# EAGLE design ABS-Pro-Mini (EAGLE 7.2.0)
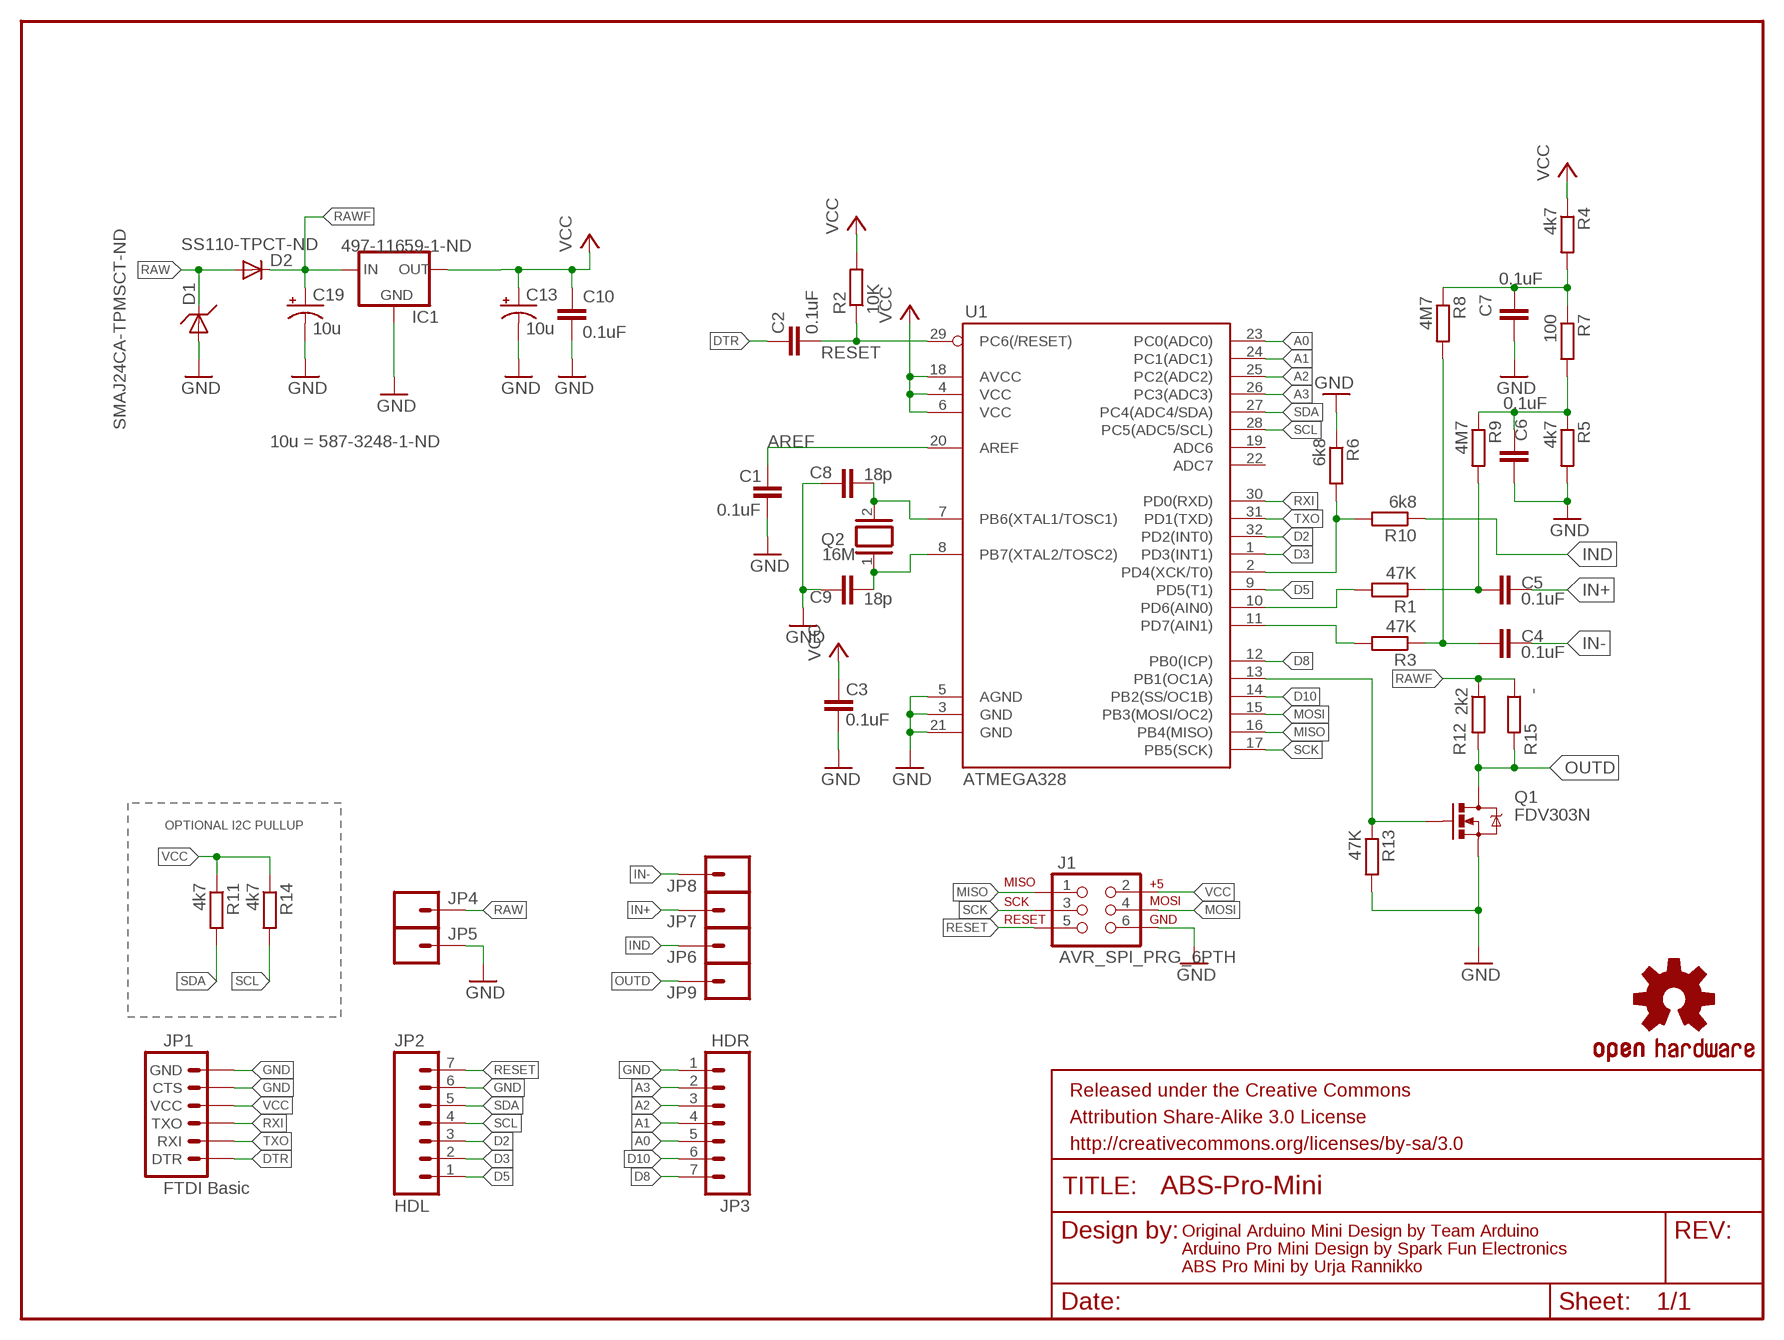
[diagram p0: schematic, sheet 1]

## Parts
C1  0.1uF  CAP0603-CAP  [0603-CAP]
C2  0.1uF  CAP0603-CAP  [0603-CAP]
C3  0.1uF  CAP0603-CAP  [0603-CAP]
C4  0.1uF  CAP0603-CAP  [0603-CAP]
C5  0.1uF  CAP0603-CAP  [0603-CAP]
C6  0.1uF  CAP0603-CAP  [0603-CAP]
C7  0.1uF  CAP0603-CAP  [0603-CAP]
C8  18p  CAP0603-CAP  [0603-CAP]
C9  18p  CAP0603-CAP  [0603-CAP]
C10  0.1uF  CAP0603-CAP  [0603-CAP]
C13  10u  CAP_POL1206  [EIA3216]
C19  10u  CAP_POL1206  [EIA3216]
D1  SMAJ24CA-TPMSCT-ND  DIODESMA  [SMA-DIODE]
D2  SS110-TPCT-ND  DIODESMA  [SMA-DIODE]
FRAME1  FRAME-LETTER  [CREATIVE_COMMONS]
IC1  497-11659-1-ND  V_REG_MIC2920MG  [SOT223]
J1  AVR_SPI_PRG_6PTH  [2X3]
JP1  FTDI Basic  ARDUINO_SERIAL_PROGRAMPTH  [1X06]
JP2  HDL  M07  [1X07]
JP3  HDR  M07  [1X07]
JP4  M01PTH_2MM  [1X01_2MM]
JP5  M01PTH_2MM  [1X01_2MM]
JP6  M01PTH_2MM  [1X01_2MM]
JP7  M01PTH_2MM  [1X01_2MM]
JP8  M01PTH_2MM  [1X01_2MM]
JP9  M01PTH_2MM  [1X01_2MM]
Q1  FDV303N  MOSFET-NCHANNELBSS123LT1G  [SOT23]
Q2  16M  XTAL/S  [QS]
R1  47K  R-EU_R0805  [R0805]
R2  10K  R-EU_R0805  [R0805]
R3  47K  R-EU_R0805  [R0805]
R4  4k7  R-EU_R0805  [R0805]
R5  4k7  R-EU_R0805  [R0805]
R6  6k8  R-EU_R0805  [R0805]
R7  100  R-EU_R0805  [R0805]
R8  4M7  R-EU_0207/12  [0207/12]
R9  4M7  R-EU_0207/12  [0207/12]
R10  6k8  R-EU_R0805  [R0805]
R11  4k7  R-EU_R0805  [R0805]
R12  2k2  R-EU_R0805  [R0805]
R13  47K  R-EU_R0805  [R0805]
R14  4k7  R-EU_R0805  [R0805]
R15  -  R-EU_R0805  [R0805]
U1  ATMEGA328  ATMEGA168  [TQFP32-08]
U$3  OSHW-LOGOS  [OSHW-LOGO-S]

## Nets
A0: JP3.5 U1.23(PC0(ADC0))
A1: JP3.4 U1.24(PC1(ADC1))
A2: JP3.3 U1.25(PC2(ADC2))
A3: JP3.2 U1.26(PC3(ADC3))
AREF: C1.2 U1.20(AREF)
BIASH: C7.1 R4.2 R7.1 R8.1
BIASL: C6.1 R5.1 R7.2 R9.1
CIN+: C5.2 R1.1 R9.2
CIN-: C4.2 R3.1 R8.2
D2: JP2.3 U1.32(PD2(INT0))
D3: JP2.2 U1.1(PD3(INT1))
D5: JP2.1 U1.9(PD5(T1))
D8: JP3.7 U1.12(PB0(ICP))
D10: JP3.6 U1.14(PB2(SS/OC1B))
DIN+: R1.2 U1.10(PD6(AIN0))
DIN-: R3.2 U1.11(PD7(AIN1))
DTR: C2.2 JP1.1(DTR)
GND [vcc]: C1.1 C3.1 C6.2 C7.2 C8.2 C9.2 C10.2 C13.C(-) C19.C(-) D1.A IC1.2(GND) IC1.4(GND) J1.6 JP1.5(CTS) JP1.6(GND) JP2.6 JP3.1 JP5.1 Q1.2(S) R5.2 R6.1 R13.2 U1.3(GND) U1.5(AGND) U1.21(GND)
IN+: C5.1 JP7.1
IN-: C4.1 JP8.1
IND: JP6.1 R10.1
INDLV: R6.2 R10.2 U1.2(PD4(XCK/T0))
MISO: J1.1 U1.16(PB4(MISO))
MOSI: J1.4 U1.15(PB3(MOSI/OC2))
N$1: C9.1 Q2.1 U1.8(PB7(XTAL2/TOSC2))
N$2: C8.1 Q2.2 U1.7(PB6(XTAL1/TOSC1))
OUTD: JP9.1 Q1.3(D) R12.2 R15.2
OUTD_CTRL: Q1.1(G) R13.1 U1.13(PB1(OC1A))
RAW [vcc]: D1.C D2.A JP4.1
RAWF: C19.A(+) D2.C IC1.1(IN) R12.1 R15.1
RESET: C2.1 J1.5 JP2.7 R2.1 U1.29(PC6(/RESET))
RXI: JP1.3(TXO) U1.30(PD0(RXD))
SCK: J1.3 U1.17(PB5(SCK))
SCL: JP2.4 R14.2 U1.28(PC5(ADC5/SCL))
SDA: JP2.5 R11.2 U1.27(PC4(ADC4/SDA))
TXO: JP1.2(RXI) U1.31(PD1(TXD))
VCC: C3.2 C10.1 C13.A(+) IC1.3(OUT) J1.2 JP1.4(VCC) R2.2 R4.1 R11.1 R14.1 U1.4(VCC) U1.6(VCC) U1.18(AVCC)
Unconnected: U1.19(ADC6) U1.22(ADC7)

## Notes on the sheet
- 10u = 587-3248-1-ND
- OPTIONAL I2C PULLUP
- Original Arduino Mini Design by Team Arduino
- Arduino Pro Mini Design by Spark Fun Electronics
- ABS Pro Mini by Urja Rannikko

## Library data of the parts
C1-C10 = SparkFun:CAP: Capacitor Standard 0603 ceramic capacitor, and 0.1" leaded capacitor.
C13 C19 = SparkFun:CAP_POL: Capacitor Polarized These are standard SMD and PTH capacitors. Normally 10uF, 47uF, and 100uF in electrolytic and tantalum varieties. Always verify the external diameter of the through hole cap, it varies with capacity, voltage, and manufacturer. The EIA devices should be standard.
D1 D2 = SparkFun-DiscreteSemi:DIODE: Diode These are standard reverse protection diodes and small signal diodes. SMA package can handle up to about 1A. SOD-323 can handle about 200mA. What the SOD-323 package when ordering, there are some mfgs out there that are 5-pin packages.
FRAME1 = SparkFun-Aesthetics:FRAME-LETTER: Schematic Frame Standard 8.5x11 US Letter frame
IC1 = SparkFun-PowerIC:V_REG_MIC2920: MIC2920A (http://www.micrel.com/_PDF/mic2920.pdf) - 400mA output LDO Regulator
J1 = SparkFun-Connectors:AVR_SPI_PRG_6: AVR ISP 6 Pin This is the reduced ISP connector for AVR programming. Common on Arduino. This footprint will take up less PCB space and can be used with a 10-pin to 6-pin adapter such as SKU: BOB-08508
JP1 = SparkFun:ARDUINO_SERIAL_PROGRAM
JP2 JP3 = SparkFun-Connectors:M07: Header 7 Standard 7-pin 0.1" header. Use with straight break away headers (SKU : PRT-00116), right angle break away headers (PRT-00553), swiss pins (PRT-00743), machine pins (PRT-00117), and female headers (PRT-00115). NOTES ON THE VARIANTS LOCK and LOCK_LONGPADS... This footprint was designed to help hold the alignment of a through-hole component (i.e. 7-pin header) while soldering it into place. You may notice that each hole has been shifted either up or down by 0.005 of an inch from it's more standard position (which is usually a perfectly straight line). This slight alteration caused the pins (the squares in the middle) to touch the edges of the holes. Because they are alternating, it causes a "brace" to hold the header in place. 0.005 has proven to be the perfect amount of "off-center" position when using our standard breakaway headers. Although looks a little odd when you look at the bare footprint, once you have a header in there, the alteration is very hard to notice. Also, if you push a header all the way into place, it is covered up entirely on the bottom side. This idea of altering the position of holes to aid alignment will be further integrated into the Sparkfun Library for other footprints. It can help hold any component with 3 or more connection pins.
JP4-JP9 = SparkFun-Connectors:M01: Header 1 Standard 1-pin 0.1" header. Use with straight break away headers (SKU : PRT-00116), right angle break away headers (PRT-00553), swiss pins (PRT-00743), machine pins (PRT-00117), and female headers (PRT-00115).
Q1 = SparkFun-DiscreteSemi:MOSFET-NCHANNEL: Common NMOSFET Parts MFG P/N Store ID Prod ID FDD8780 TRANS-09984 SI7820DN TRANS-11055 FDS6630A IC-08089 2N7002PW TRANS-11151 FQP30N06L COM-10213 TRANS-10060 BSS123LT1G TRANS-08345 BSS138 TRANS-00830 BS170 2N7000; PROD_ID: TRANS-08345
Q2 = special:XTAL/S: CRYSTAL
R1-R15 = rcl:R-EU_: RESISTOR, European symbol
U1 = SparkFun:ATMEGA168
U$3 = SparkFun:OSHW-LOGO: Open Source Hardware Logo This logo indicates the piece of hardware it is found on incorporates a OSHW license and/or adheres to the definition of open source hardware found here: http://freedomdefined.org/OSHW

## Net classes
0 default: width 0.203 mm
1 vcc: width 0.254 mm

## Board
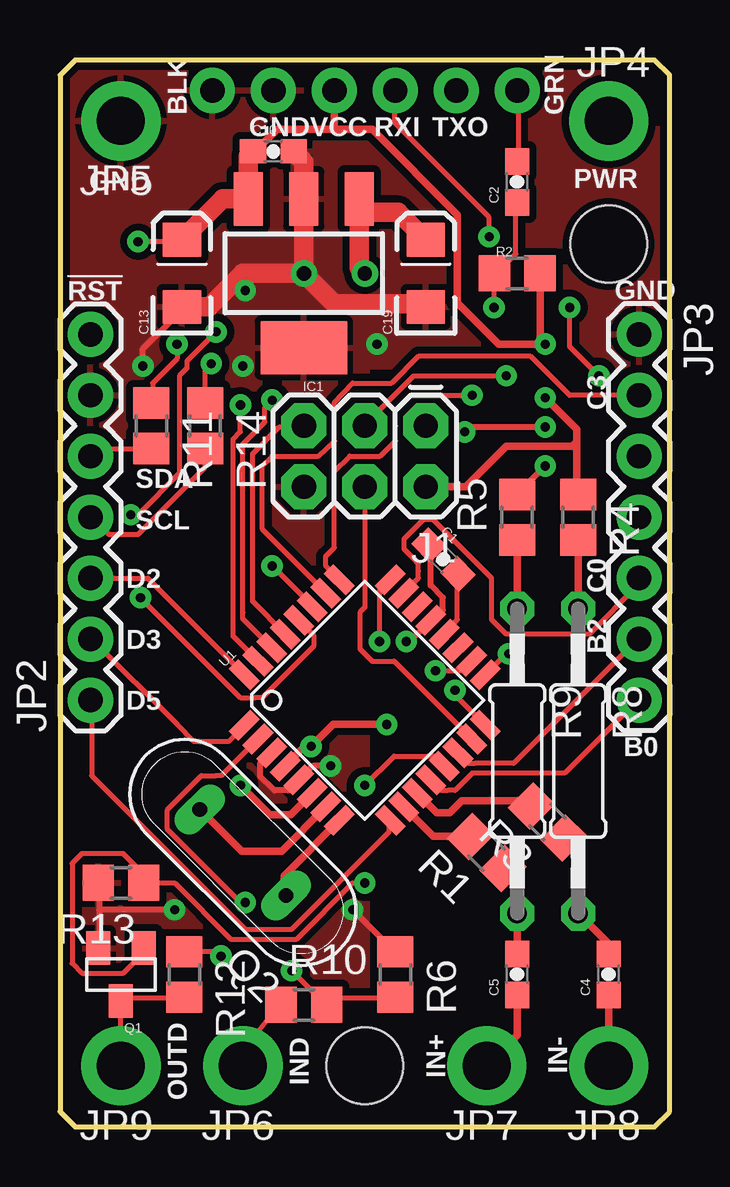
[diagram p1: board, top side]
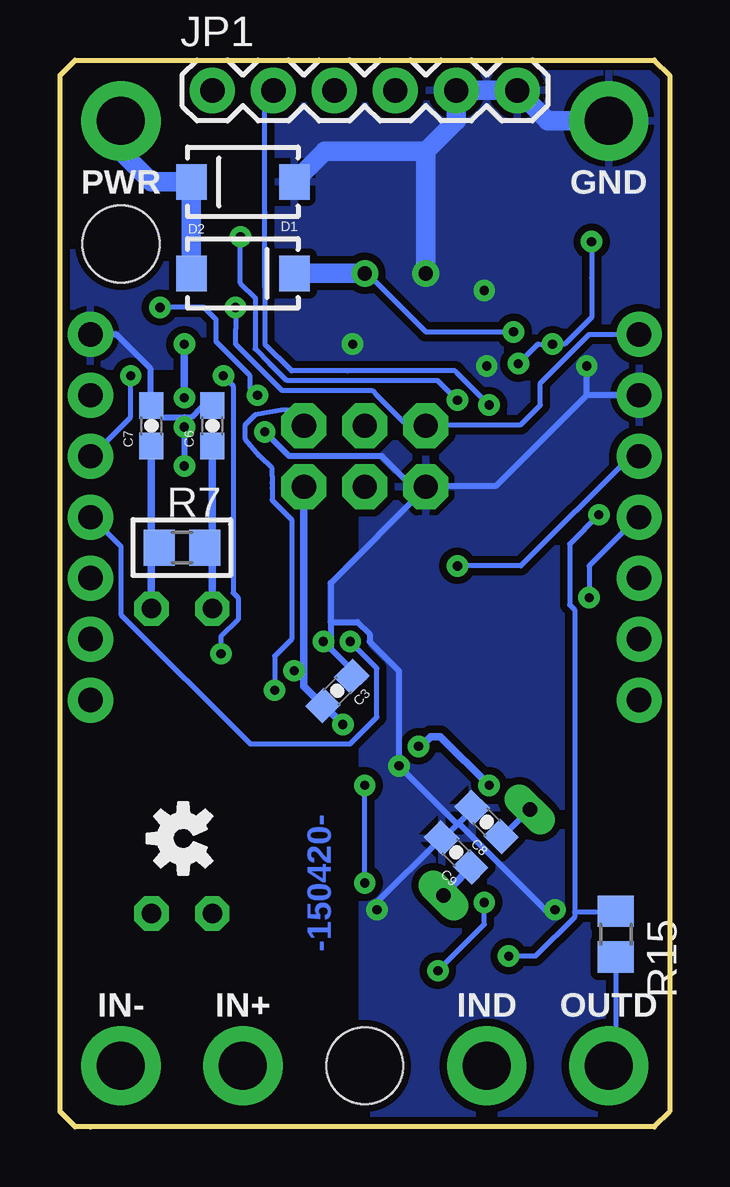
[diagram p2: board, bottom side, seen from below]

Size 25.4 x 44.45 mm. Coordinates in mm from the lower left corner, seen from the top.
Outline: 0.64,44.45 0,43.81 0,0.64 0.64,0 24.13,0 24.77,0 25.4,0.64 25.4,43.81 24.77,44.45 0.64,44.45
Copper layers (1*16): Top 0.035mm / dielectric 1.5mm / Bottom 0.035mm
Design rules "SparkFun-2-layer *": minimum track width 7mil, minimum drill 15mil, track to track 8mil, track to pad 8mil, pad to pad 8mil, via to via 8mil, smd to smd 8mil, copper to edge 8mil, drill to drill 8mil, minimum pad ring 12mil, minimum via ring 10mil, stop-mask expansion 4mil, vias tented up to drill 24mil, thermal gap 10mil
Holes 3.2 mm at 12.7,2.54 22.86,36.78

### Footprints (pad centres in the part's own frame; a part is rotated, then mirrored left to right if it is on the bottom)
0603-CAP = smd 1.1 x 1: 1 -0.85,0; 2 0.85,0
EIA3216 = smd 1.4 x 1.6: A 1.4,0; C -1.4,0
SMA-DIODE = smd 1.27 x 1.47: A -2.15,0; C 2.15,0
SOT223 = smd 1.219 x 2.235: 1 -2.311,-3.099; 2 0,-3.099; 3 2.311,-3.099 | smd 3.6 x 2.2: 4 0,3.099
2X3 = drill 1.016 pad 1.88 octagon: 1 0,0; 2 0,2.54; 3 2.54,0; 4 2.54,2.54; 5 5.08,0; 6 5.08,2.54
1X06 = drill 1.016 pad 1.88: 1 0,0; 2 2.54,0; 3 5.08,0; 4 7.62,0; 5 10.16,0; 6 12.7,0
1X07 = drill 1.016 pad 1.88: 1 0,0; 2 2.54,0; 3 5.08,0; 4 7.62,0; 5 10.16,0; 6 12.7,0; 7 15.24,0
1X01_2MM = drill 2 pad 3.302: 1 0,0
SOT23 = smd 1 x 1.4: 1 -0.95,-1.1; 2 0.95,-1.1; 3 0,1.1
QS = drill 0.61 long: 1 -2.54,0; 2 2.54,0
R0805 = smd 1.3 x 1.5: 1 -0.95,0; 2 0.95,0
0207/12 = drill 0.813 octagon: 1 -6.35,0; 2 6.35,0
TQFP32-08 = smd 1.27 x 0.559: 1 -4.293,2.8; 2 -4.293,2; 3 -4.293,1.2; 4 -4.293,0.4; 5 -4.293,-0.4; 6 -4.293,-1.2; 7 -4.293,-2; 8 -4.293,-2.8; 17 4.293,-2.8; 18 4.293,-2; 19 4.293,-1.2; 20 4.293,-0.4; 21 4.293,0.4; 22 4.293,1.2; 23 4.293,2; 24 4.293,2.8 | smd 0.559 x 1.27: 9 -2.8,-4.293; 10 -2,-4.293; 11 -1.2,-4.293; 12 -0.4,-4.293; 13 0.4,-4.293; 14 1.2,-4.293; 15 2,-4.293; 16 2.8,-4.293; 25 2.8,4.293; 26 2,4.293; 27 1.2,4.293; 28 0.4,4.293; 29 -0.4,4.293; 30 -1.2,4.293; 31 -2,4.293; 32 -2.8,4.293

### Placement (x,y rotation side)
C1  15.98,23.65 315 top
C2  19.05,39.37 90 top
C3  13.84,18.16 225 bottom
C4  22.86,6.35 90 top
C5  19.05,6.35 90 top
C6  19.05,29.21 90 bottom
C7  21.59,29.21 90 bottom
C8  7.62,12.7 135 bottom
C9  8.89,11.43 135 bottom
C10  8.89,40.64 0 top
C13  5.08,35.56 90 top
C19  15.24,35.56 90 top
D1  17.78,39.37 180 bottom
D2  17.78,35.56 0 bottom
FRAME1  -15.98,-8.89 0 top  (outside the outline)
IC1  10.16,35.56 180 top
J1  15.24,29.21 180 top
JP1  19.05,43.18 0 bottom
JP2  1.27,17.78 90 top
JP3  24.13,33.02 270 top
JP4  22.86,41.91 0 top
JP5  2.54,41.91 180 top
JP6  7.62,2.54 180 top
JP7  17.78,2.54 180 top
JP8  22.86,2.54 180 top
JP9  2.54,2.54 180 top
Q1  2.54,6.35 180 top
Q2  7.62,11.43 135 top
R1  17.78,11.43 135 top
R2  19.05,35.56 0 top
R3  20.32,12.7 135 top
R4  21.59,25.4 270 top
R5  19.05,25.4 90 top
R6  13.97,6.35 270 top
R7  20.32,24.13 0 bottom
R8  21.59,15.24 270 top
R9  19.05,15.24 270 top
R10  10.16,5.08 0 top
R11  3.81,29.21 270 top
R12  5.18,6.35 270 top
R13  2.54,10.16 180 top
R14  6.05,29.21 270 top
R15  2.24,8.03 270 bottom
U1  12.7,17.78 45 top
U$3  20.27,12.01 90 bottom

### Tracks (layer width: path | path; a pad name or v marks a point on that pad's centre or on a via)
A0
  Top 0.203: U1.23 14.33,22.25 14.94,22.86 14.94,23.16 14.94,23.47 14.73,23.67 14.33,24.08 14.33,24.49 15.14,25.3 15.54,25.3 17.98,22.86 17.98,21.13 18.59,20.52 22.05,20.52 24.08,22.55 24.08,22.86 JP3.5
A1  (via drill 0.38)
  Top 0.203: U1.24 13.31,22.35 v13.31,20.22
  Bottom 0.203: v13.31,20.22 12.19,19.1 12.19,17.07 13.31,15.95 17.48,15.95 22.86,21.34 22.86,24.18 24.08,25.4 JP3.4
A2  (via drill 0.38)
  Top 0.203: U1.25 11.58,22.86 11.07,23.37 11.07,23.77 11.43,24.13 11.43,27.3 12.06,27.94 13.34,27.94 13.97,28.57 13.97,29.21 13.97,29.84 14.61,30.48 v17.17,30.48 | v21.23,34.14 21.23,32.51 v22.45,31.29
  Bottom 0.203: v22.45,31.29 22.45,29.57 24.08,27.94 JP3.3 | v17.17,30.48 17.48,30.79 17.48,31.29 18.9,32.72 18.9,33.63 19.41,34.14 v21.23,34.14
A3
  Top 0.203: U1.26 11.07,22.25 8.43,24.89 8.43,27.53 8.84,27.94 10.77,27.94 11.43,28.57 11.43,30.18 12.19,30.99 13.82,30.99 14.94,32.11 19.61,32.11 21.23,30.48 24.08,30.48 JP3.2
AREF
  Top 0.203: C1.2 16.56,22.96 16.56,21.13 16.05,20.62 U1.20
BIASH
  Top 0.305: R4.2 R8.1
  Bottom 0.305: R8.1 21.59,24.13 R7.1 21.27,24.45 R4.2 C7.1
BIASL
  Top 0.305: R5.1 R9.1
  Bottom 0.305: R9.1 19.05,24.13 R7.2 19.37,24.45 R5.1 C6.1
CIN+
  Top 0.305: C5.2 R9.2 19.05,10.16 | 19.05,10.16 | 19.05,10.16 R1.1
CIN-
  Top 0.305: C4.2 22.86,7.62 R8.2 21.59,11.43 R3.1
D2
  Top 0.203: U1.32 7.62,18.9 3.66,22.86 1.32,22.86 JP2.3
D3
  Top 0.203: JP2.2 1.32,20.32 4.88,16.76 5.59,16.05 6.5,16.05 7.01,16.05 U1.1
D5
  Top 0.203: U1.9 13.72,12.7 13.72,12.29 9.65,8.23 7.72,8.23 1.32,14.63 1.32,17.78 JP2.1
D8
  Top 0.203: JP3.7 24.08,17.78 21.03,14.73 17.17,14.73 16.46,14.02 16.15,14.02 15.89,14.02 U1.12
D10
  Top 0.203: JP3.6 24.08,20.32 18.9,15.14 17.27,15.14 17.04,15.14 U1.14
DIN+
  Top 0.305: U1.10 15.55,12.1 R1.2
DIN-
  Top 0.305: U1.11 15.41,13.37 15.7,13.08 16.23,13.08 16.74,13.59 18.54,13.59 19.43,13.59 arc-90 R3.2
DTR
  Top 0.203: C2.2 19.1,40.23 19.1,43.18 JP1.1
GND  (via drill 0.38, 0.6)
  Top 0.254: 1.63,9.04 1.63,10.16 R13.2 | 1.63,9.04 1.63,7.52 Q1.2 | U1.3 8.74,15.54 8.33,15.14 8.33,14.63 8.94,14.02 9.51,14.02 U1.5 10.52,15.04 10.57,15.04 11.18,15.04 v11.28,15.04 | v12.19,9.04 13.92,7.32 R6.1 | v4.78,9.04 1.73,9.04 1.63,9.04 | v20.22,27.53 19.1,26.42 R5.2 | C1.1 15.44,24.18 15.44,22.55 15.95,22.05 15.95,21.54 15.54,21.13 U1.21 14.57,20.22 v14.43,20.22 | v20.22,29.16 17.07,29.16 v16.87,28.96 | v3.45,31.7 3.45,32.41 4.88,33.83 C13.C
  Top 0.813: v10.16,35.56 10.16,38.1 | 10.16,38.1 IC1.2 | C10.2 10.16,40.22 10.16,39.37 10.16,38.1 | v10.16,35.56 7.62,35.56 6.22,34.16 C13.C | C19.C 15.11,34.29 11.43,34.29 v10.16,35.56
  Bottom 0.254: 8.84,12.6 9.45,11.99 C9.2 9.55,11.99 12.19,9.35 v12.19,9.04 | 8.84,12.6 8.79,12.65 | 8.79,12.65 8.23,13.21 C8.2 | 8.84,12.6 v11.28,15.04 11.28,15.14 11.28,19 12.5,20.22 12.5,20.52 13.01,21.03 14.02,21.03 14.12,21.03 | v4.78,9.04 5.18,9.04 8.74,12.6 8.79,12.65 | 20.22,29.57 21.13,29.57 21.54,29.97 C7.2 21.64,30.18 21.64,31.6 23.06,33.02 24.08,33.02 JP3.1 | 20.22,29.57 19.91,29.57 19.51,29.97 19.1,29.97 C6.2 | v20.22,27.53 v20.22,29.16 20.22,29.46 20.22,29.57 | 14.12,21.03 14.12,22.66 10.16,26.62 J1.6 | 14.12,21.03 14.12,20.22 | 14.12,20.22 14.12,19.91 13.31,19.1 13.31,18.8 C3.1 | v14.43,20.22 14.22,20.22 14.12,20.22 | JP2.6 1.32,30.48 3.45,30.48 | J1.6 10.06,26.72 7.21,26.72 3.45,30.48 | v16.87,28.96 15.85,27.94 11.99,27.94 10.46,26.42 J1.6 | v3.45,31.7 3.45,30.58 3.45,30.48
  Bottom 0.813: JP5.1 5.08,41.91 JP1.6 JP1.5 8.89,41.91 10.16,40.64 | 10.16,40.64 14.36,40.64 D1.A | 10.16,40.64 v10.16,35.56
  other vias: 13.21,32.61 7.62,31.7 7.72,34.85
  pour Top (isolate 0.305): 0,0 12.8,0 12.8,31.7 25.4,31.7 25.4,44.5 0,44.5
  pour Bottom (isolate 0.305): 0,0 12.8,0 12.8,31.7 25.4,31.7 25.4,44.5 0,44.5
  pour Bottom (isolate 0.254): 12.8,21.03 14.12,21.03 14.12,22.66 12.9,23.88 12.8,23.98
IN+
  Top 0.305: JP7.1 19.05,3.81 C5.1
IN-
  Top 0.305: JP8.1 C4.1
IND
  Top 0.203: JP6.1 7.62,3.15 9.14,5.08 R10.1
INDLV  (via drill 0.38)
  Top 0.203: v7.72,9.35 7.52,9.35 4.47,12.39 4.47,13.21 5.89,14.63 6.5,14.63 6.72,14.63 U1.2 | v9.65,6.5 11.07,5.08 R10.2 11.18,5.08 11.48,5.38 13.92,5.38 R6.2
  Bottom 0.203: v7.72,9.35 7.72,8.43 v9.65,6.5
MISO  (via drill 0.38)
  Top 0.203: U1.16 16.46,17.98 v16.46,18.19
  Bottom 0.203: J1.1 15.24,29.26 15.85,29.87 16.05,29.87 17.27,29.67 17.68,29.26 17.68,28.65 17.07,27.94 16.56,27.43 16.56,27.13 16.56,26.82 16.56,26.62 16.56,26.11 15.95,25.5 15.75,25.3 15.75,20.32 16.36,19.71 16.46,19.61 v16.46,18.19
MOSI
  Top 0.203: U1.15 17.07,16.26 13.92,19.41 13.01,19.41 12.5,19.91 12.5,21.44 12.7,21.64 12.7,26.62 J1.4
N$1
  Top 0.305: U1.8 9.35,10.47 9.35,10.46 9.35,9.7 Q2.1
  Bottom 0.305: Q2.1 C9.1
N$2
  Top 0.305: U1.7 9.23,11.48 7.62,11.48 7.57,11.48 Q2.2
  Bottom 0.254: Q2.2 6.95,12.1 C8.1
OUTD
  Top 0.203: JP9.1 2.54,5.18 Q1.3 2.54,5.28 2.64,5.38 5.08,5.38 R12.2
  Bottom 0.203: R15.2 2.23,2.85 JP9.1
OUTD_CTRL  (via drill 0.38)
  Top 0.203: v12.7,14.22 13.92,15.44 15.34,15.44 15.6,15.44 U1.13 | v12.7,10.16 12.19,10.16 9.86,7.82 7.11,7.82 4.78,10.16 3.86,10.16 | 3.86,10.16 3.56,10.16 R13.1 3.86,10.16 | 3.86,10.16 2.64,11.38 0.91,11.38 0.51,10.97 0.51,6.81 0.91,6.4 2.64,6.4 3.66,7.42 Q1.1
  Bottom 0.203: v12.7,10.16 v12.7,14.22
RAW
  Bottom 0.813: JP4.1 22.86,40.64 21.59,39.37 D1.C D2.A
RAWF  (via drill 0.38, 0.6)
  Top 0.203: v6.5,33.12 5.28,31.9 5.28,31.6 4.98,31.29 4.98,27.23 3.25,25.5 v2.95,25.5 | 5.08,7.32 5.18,7.32 | 5.18,7.32 6.5,7.32 v6.71,7.11 | R12.1 5.18,7.32
  Top 0.813: IC1.1 12.47,38.1 | 12.47,38.1 12.47,35.79 v12.7,35.56 | C19.A 14.1,38.1 12.47,38.1
  Bottom 0.203: v6.71,7.11 5.59,7.11 3.96,8.74 3.96,8.94 | 3.96,8.94 3.96,21.54 4.17,21.74 4.17,24.28 v2.95,25.5 | v6.5,33.12 10.16,33.12 12.39,35.36 v12.7,35.56 | R15.1 2.27,8.94 3.96,8.94
  Bottom 0.813: v12.7,35.56 D2.C
RESET  (via drill 0.38)
  Top 0.203: C2.1 19,38.51 19,36.37 18.19,35.56 R2.1 18.09,35.56 v18.09,34.14 | U1.29 8.03,21.89 8.03,22.15 8.03,28.04 9.14,29.16 10.11,29.16 J1.5
  Bottom 0.203: 10.16,29.26 J1.5 | 10.16,29.26 J1.5 | JP2.7 1.32,33.02 3.35,33.02 5.38,30.99 5.38,30.07 6.2,29.26 10.16,29.26 | 10.16,29.26 10.97,29.26 12.19,30.48 12.39,30.68 16.15,30.68 17.37,31.9 18.09,32.61 18.09,33.22 v18.09,34.14 | 10.16,29.26 J1.5
RXI  (via drill 0.38)
  Top 0.203: U1.30 7.62,21.16 7.62,21.44 7.62,28.45 8.53,29.36 8.53,29.97 v8.84,30.28 | v17.88,37.08 17.88,37.9 13.92,41.86 13.92,43.18 JP1.3
  Bottom 0.203: v17.88,37.08 17.88,35.15 17.27,34.54 17.27,32.41 16.66,31.8 15.95,31.09 9.65,31.09 9.55,30.99 v8.84,30.28
SCK  (via drill 0.38)
  Top 0.203: v18.69,19.71 18.59,19.71 17.78,18.9 U1.17 | v18.59,31.29 14.73,31.29 12.7,29.26 J1.3
  Bottom 0.203: v18.69,19.71 18.69,20.42 17.98,21.13 17.98,22.05 18.19,22.25 18.19,30.89 v18.59,31.29
SCL  (via drill 0.38)
  Top 0.203: v3.35,22.05 7.52,17.88 8.13,17.88 8.43,17.88 10.57,20.02 10.57,20.48 U1.28 9.95,21.04 | JP2.4 1.32,25.4 2.03,24.69 3.25,24.69 6.04,27.48 R14.2 | 9.95,21.04 9.96,21.03 9.95,21.04
  Bottom 0.203: v3.35,22.05 3.35,23.37 1.32,25.4 JP2.4
SDA  (via drill 0.38)
  Top 0.203: v8.84,23.37 10.46,21.74 U1.27 | R11.2 3.76,28.25 1.63,28.25 1.32,27.94 JP2.5
  Bottom 0.203: v8.84,23.37 6.2,23.37 1.63,27.94 1.32,27.94 JP2.5
TXO  (via drill 0.38)
  Top 0.203: U1.31 7.23,20.42 7.21,20.42 7.21,28.65 7.52,28.96 v7.52,30.07
  Bottom 0.203: v7.52,30.07 8.53,31.09 8.84,31.39 8.94,31.5 13.41,31.5 15.75,31.5 16.87,32.61 16.87,34.95 16.87,38.1 16.87,42.88 16.56,43.18 JP1.2
VCC  (via drill 0.38)
  Top 0.203: v15.65,19 16.46,19 16.76,19 17.07,19.3 U1.18 | 21.54,26.42 R4.1 | v4.88,32.61 4.88,32 3.86,30.99 3.86,30.18 R11.1 | v3.25,36.88 4.78,36.88 C13.A | 19.91,35.56 R2.2 | 8.33,40.84 C10.1 | R14.1 6.04,31.55 v6.3,31.8
  Top 0.305: 8.33,40.84 9.04,41.55 11.43,41.55 | 11.43,41.55 13.01,41.55 | 13.01,41.55 16.56,38 16.56,37.69 16.56,34.34 18.29,32.61 v20.22,32.61 20,32.83 R2.2 | JP1.4 11.43,41.55 | 11.43,41.55 13.01,41.55 | J1.2 16.92,26.67 18.59,28.35 21.34,28.35 21.54,28.55 | 21.54,28.55 21.54,29.06 v20.22,30.38 | 21.54,26.42 21.54,28.55 | v13.61,16.76 11.38,16.76 v10.46,15.85 10.2,15.85 U1.4 9.29,14.94 | U1.6 9.62,13.01 8.74,13.01 v7.52,14.22
  Top 0.813: C10.1 7.85,40.45 IC1.3 6.78,38.66 C13.A
  Bottom 0.203: v6.3,31.8 5.49,32.61 v4.88,32.61 4.37,32.61 3.25,33.73 3.25,35.36 v3.25,36.88
  Bottom 0.305: v20.22,32.61 v20.22,30.38 | 15.24,19 15.24,26.62 J1.2 | 15.24,19 15.24,18.36 | 15.24,18.36 C3.2 14.41,17.56 v13.61,16.76 | 15.24,18.36 15.24,19 | 15.24,19 v15.65,19 | v7.52,14.22 9.55,16.26 9.96,16.26 10.36,15.85 v10.46,15.85

### Text on the board
Bottom: -150420-
tPlace: BLK | GRN | GND | VCC | RXI | TXO | GND | PWR | !RST | GND | C3 | SDA | SCL | D2 | C0 | D3 | B2 | D5 | B0 | IN+ | IN- | IND | OUTD
bPlace: GND | PWR | OUTD | IND | IN+ | IN-
tDocu: Original Arduino Mini Design by Team Arduino / Arduino Pro Mini Design by SparkFun Electronics / Revised by Pete Lewis / Modified to be the ABS Sensor Edition by Urja Rannikko